# EAGLE design dam1941_extender (EAGLE 9.3.1)
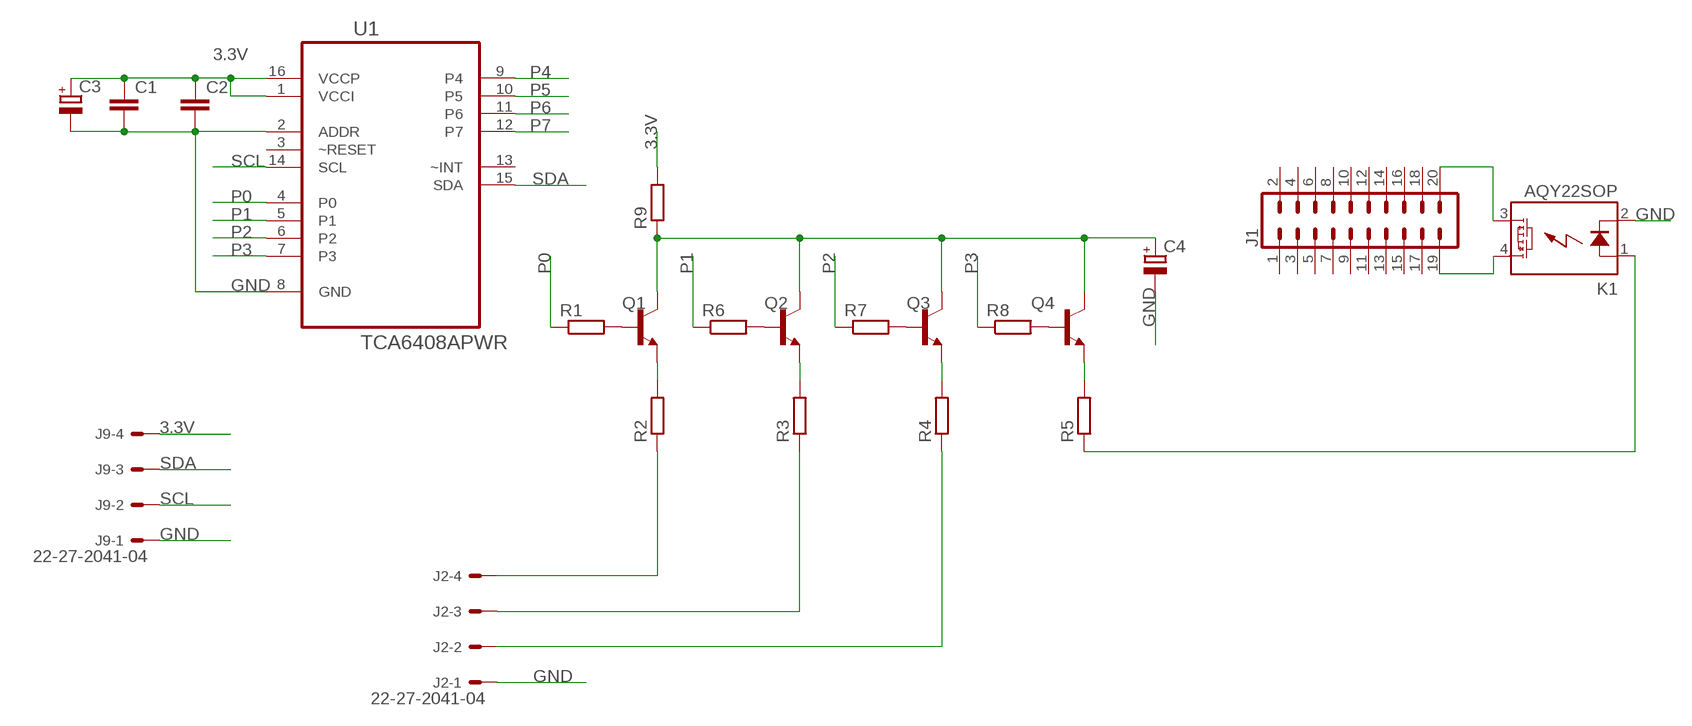
[diagram p0: schematic, sheet 1]

## Parts
C1  C-EUC0805  [C0805]
C2  C-EUC0805  [C0805]
C3  CPOL-EUE2.5-6  [E2,5-6]
C4  CPOL-EUE2.5-6  [E2,5-6]
J1  CONN_10X22X10_LOCK  [2X10_LOCK]
J2  22-27-2041-04  [6410-04]
J9  22-27-2041-04  [6410-04]
K1  AQY22SOP  [SOP04]
Q1  TRANSISTOR_BC850-NPN-SOT23-BEC  [TRANSISTOR_SOT23-BEC]
Q2  TRANSISTOR_BC850-NPN-SOT23-BEC  [TRANSISTOR_SOT23-BEC]
Q3  TRANSISTOR_BC850-NPN-SOT23-BEC  [TRANSISTOR_SOT23-BEC]
Q4  TRANSISTOR_BC850-NPN-SOT23-BEC  [TRANSISTOR_SOT23-BEC]
R1  R-EU_MELF0204W  [MINI_MELF-0204W]
R2  R-EU_MELF0204W  [MINI_MELF-0204W]
R3  R-EU_MELF0204W  [MINI_MELF-0204W]
R4  R-EU_MELF0204W  [MINI_MELF-0204W]
R5  R-EU_MELF0204W  [MINI_MELF-0204W]
R6  R-EU_MELF0204W  [MINI_MELF-0204W]
R7  R-EU_MELF0204W  [MINI_MELF-0204W]
R8  R-EU_MELF0204W  [MINI_MELF-0204W]
R9  R-EU_MELF0204W  [MINI_MELF-0204W]
U1  TCA6408APWR  [SOP65P640X120-16N]

## Nets
3.3V: C1.1 C2.1 C3.+ J9.4 R9.2 U1.1(VCCI) U1.16(VCCP)
GND: C1.2 C2.2 C3.- C4.- J2.1 J9.1 K1.2(K) U1.2(ADDR) U1.8(GND)
N$1: J1.20 K1.3(DS2)
N$2: J1.19 K1.4(DS1)
N$3: C4.+ Q1.C Q2.C Q3.C Q4.C R9.1
N$4: Q1.E R2.2
N$5: Q3.B R7.2
N$6: Q4.B R8.2
N$7: Q2.B R6.2
N$8: Q1.B R1.2
N$9: Q2.E R3.2
N$10: Q3.E R4.2
N$11: Q4.E R5.2
N$12: J2.4 R2.1
N$13: K1.1(A) R5.1
N$14: J2.3 R3.1
N$15: J2.2 R4.1
P0: R1.1 U1.4(P0)
P1: R6.1 U1.5(P1)
P2: R7.1 U1.6(P2)
P3: R8.1 U1.7(P3)
P4: U1.9(P4)
P5: U1.10(P5)
P6: U1.11(P6)
P7: U1.12(P7)
SCL: J9.2 U1.14(SCL)
SDA: J9.3 U1.15(SDA)
Unconnected: J1.1 J1.2 J1.3 J1.4 J1.5 J1.6 J1.7 J1.8 J1.9 J1.10 J1.11 J1.12 J1.13 J1.14 J1.15 J1.16 J1.17 J1.18 U1.3(~RESET) U1.13(~INT)

## Library data of the parts
C1 C2 = Vwvwbg:C-EU: CAPACITOR, European symbol
C3 C4 = Vwvwbg:CPOL-EU: POLARIZED CAPACITOR, European symbol
J1 = SparkFun-Connectors:CONN_10X2: Multi connection point. Often used as Generic Header-pin footprint for 0.1 inch spaced/style header connections On any of the 0.1 inch spaced packages, you can populate with these: Break Away Headers - Straight <https://www.sparkfun.com/products/116> (PRT-00116) Break Away Male Headers - Right Angle <https://www.sparkfun.com/products/553> (PRT-00553) Female Headers <https://www.sparkfun.com/products/115> (PRT-00115) Break Away Headers - Machine Pin <https://www.sparkfun.com/products/117> (PRT-00117) Break Away Female Headers - Swiss Machine Pin <https://www.sparkfun.com/products/743> (PRT-00743) Special note about the "SPECIAL" package: This was SPECIALLY designed to be used with our Graphic LCD Backpack. Be sure you want to use this! It is not only staggered on each line of header holes, but IT IS ALSO offset of the center point of the top and bottom lines by 5 mil. This causes the headers to lock into place on the "standard" footprint on the LCD screen. The extra squares on the tdocu layer are there simply to reference other pins (if you were to actually populate a longer header than ten long - this is what we do with the backpacks).
J2 J9 = con-molex:22-?-04: CONNECTOR wire to board 2.54 mm (.1 inch) pitch header; MF: MOLEX; OC_FARNELL: unknown; OC_NEWARK: unknown
K1 = relay:AQY*: PhotoMOS Relay NAiS Source: http://www.panasonic-electric-works.com/catalogues/downloads/photomos/ds_x615_en_aqz10_20.pdf; OC_FARNELL: unknown; OC_NEWARK: unknown
Q1-Q4 = Vwvwbg:TRANSISTOR_*-NPN-: NPN Transistror BF959 corrected 2008.03.06
R1-R9 = Vwvwbg:R-EU_: RESISTOR, European symbol
U1 = Texas Instruments_By_element14_Batch_1:TCA6408APWR: I/O EXPANDER; MPN: TCA6408APWR; OC_FARNELL: 1903303; OC_NEWARK: 24R9973; PACKAGE: TSSOP-16; SUPPLIER: Texas Instruments

## Board
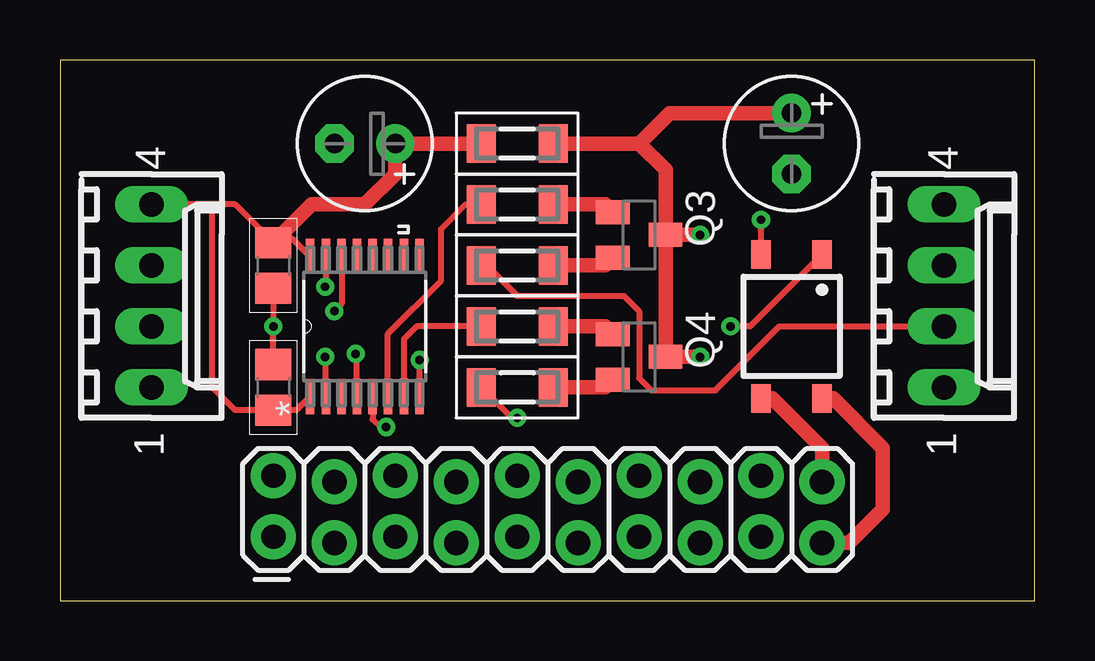
[diagram p1: board, top side]
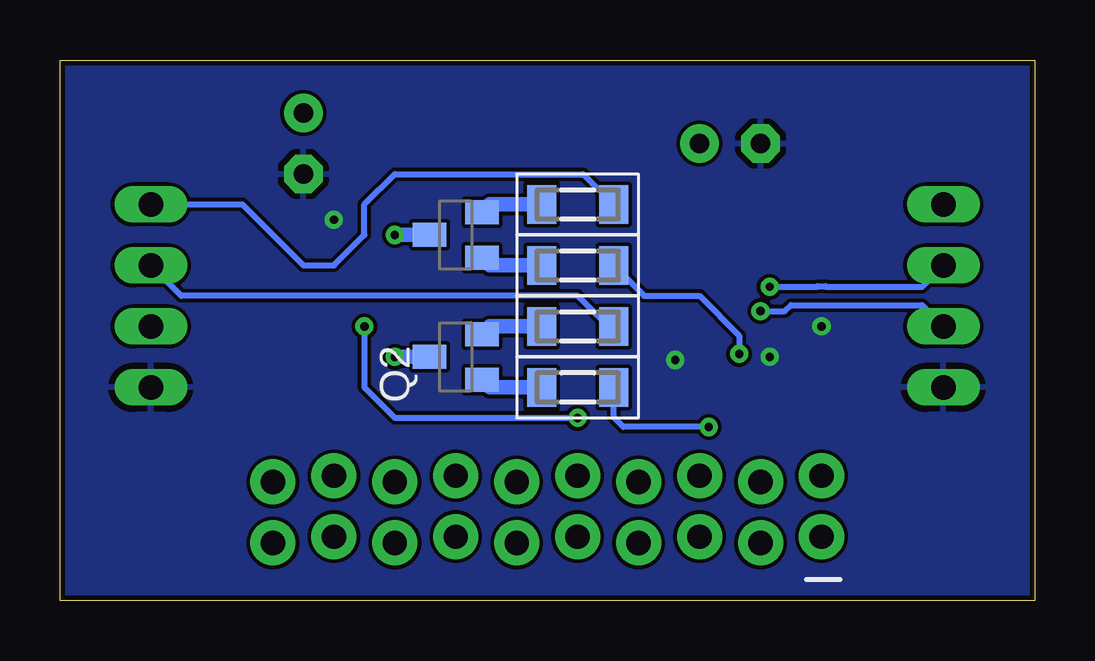
[diagram p2: board, bottom side, seen from below]

Size 40.62 x 22.53 mm. Coordinates in mm from the lower left corner, seen from the top.
Outline: 0,0 40.62,0 40.62,22.53 0,22.53 0,0
Copper layers (1*16): Top 0.035mm / dielectric 1.5mm / Bottom 0.035mm
Design rules "default *": minimum track width 6mil, minimum drill 0.35mm, track to track 6mil, track to pad 6mil, pad to pad 6mil, via to via 6mil, smd to smd 6mil, copper to edge 8mil, drill to drill 6mil, minimum pad ring 10mil, minimum via ring 8mil, stop-mask expansion 4mil, vias tented up to drill 0.36mm, thermal gap 10mil

### Footprints (pad centres in the part's own frame; a part is rotated, then mirrored left to right if it is on the bottom)
C0805 = smd 1.3 x 1.5: 1 -0.95,0; 2 0.95,0
E2,5-6 = drill 0.813 pad 1.6: + -1.27,0 | drill 0.813 pad 1.6 octagon: - 1.27,0
2X10_LOCK = drill 1.016 pad 1.88: 1 0,0.127; 2 0,2.667; 3 2.54,-0.127; 4 2.54,2.413; 5 5.08,0.127; 6 5.08,2.667; 7 7.62,-0.127; 8 7.62,2.413; 9 10.16,0.127; 10 10.16,2.667; 11 12.7,-0.127; 12 12.7,2.413; 13 15.24,0.127; 14 15.24,2.667; 15 17.78,-0.127; 16 17.78,2.413; 17 20.32,0.127; 18 20.32,2.667; 19 22.86,-0.127; 20 22.86,2.413
6410-04 = drill 1.016 long: 1 3.81,0; 2 1.27,0; 3 -1.27,0; 4 -3.81,0
SOP04 = smd 0.8 x 1.2: 1 -1.27,-3; 2 1.27,-3; 3 1.27,3; 4 -1.27,3
TRANSISTOR_SOT23-BEC = smd 1 x 1.4: B -0.95,-1.1; C 0,1.1; E 0.95,-1.1
MINI_MELF-0204W = smd 1.2 x 1.6: 1 -1.5,0; 2 1.5,0
SOP65P640X120-16N = smd 1.473 x 0.356: 1 -2.921,2.286; 2 -2.921,1.626; 3 -2.921,0.965; 4 -2.921,0.33; 5 -2.921,-0.33; 6 -2.921,-0.965; 7 -2.921,-1.626; 8 -2.921,-2.286; 9 2.921,-2.286; 10 2.921,-1.626; 11 2.921,-0.965; 12 2.921,-0.33; 13 2.921,0.33; 14 2.921,0.965; 15 2.921,1.626; 16 2.921,2.286

### Placement (x,y rotation side)
C1  8.89,13.97 270 top
C2  8.89,8.89 90 top
C3  12.7,19.05 180 top
C4  30.48,19.05 270 top
J1  8.89,2.54 0 top
J2  36.83,12.7 270 top
J9  3.81,12.7 270 top
K1  30.48,11.43 180 top
Q1  24.13,15.24 90 bottom
Q2  24.13,10.16 90 bottom
Q3  24.13,15.24 270 top
Q4  24.13,10.16 270 top
R1  19.05,13.97 180 bottom
R2  19.05,16.51 180 bottom
R3  19.05,11.43 180 bottom
R4  19.05,13.97 0 top
R5  19.05,8.89 0 top
R6  19.05,8.89 180 bottom
R7  19.05,16.51 0 top
R8  19.05,11.43 0 top
R9  19.05,19.05 180 top
U1  12.7,11.43 90 top

### Tracks (layer width: path | path; a pad name or v marks a point on that pad's centre or on a via)
3.3V
  Top 0.254: C1.1 8.73,15.08 | 8.73,15.08 7.3,16.51 6.35,16.51 | 6.35,16.51 J9.4 | U1.16 9.69,15.08 8.73,15.08 | U1.1 9.85,7.94 C2.1 7.3,7.94 6.35,8.89 6.35,16.51
  Top 0.61: C1.1 10.48,16.51 12.7,16.51 13.97,17.78 C3.+ R9.2
GND  (via drill 0.35)
  Top 0.254: C2.2 v8.89,11.43 C1.2 | U1.8 v14.99,10.03 | U1.2 11.07,10.13 v11.05,10.16 | K1.2 v29.21,15.88
  pour Bottom: 0,24.13 40.64,24.13 40.64,0 0,0
N$1
  Top 0.61: J1.20 31.75,6.35 29.67,8.43 K1.3
N$2
  Top 0.61: J1.19 32.89,2.41 34.29,3.81 34.29,6.35 32.21,8.43 K1.4
N$3  (via drill 0.35)
  Top 0.61: Q3.C 25.23,17.95 24.13,19.05 | 24.13,19.05 R9.1 | Q3.C Q2.C v26.67,10.16 | 24.13,19.05 25.4,20.32 C4.+ | v26.67,15.24 Q3.C
  Bottom 0.61: Q3.C v26.67,15.24 | v26.67,10.16 Q2.C
N$4
  Bottom 0.61: Q1.E 22.71,16.51 R2.2
N$5
  Top 0.61: Q3.B 22.71,16.51 R7.2
N$6
  Top 0.61: Q4.B 22.71,11.43 R8.2
N$7
  Bottom 0.61: Q2.B 22.71,8.89 R6.2
N$8
  Bottom 0.61: Q1.B 22.71,13.97 R1.2
N$9
  Bottom 0.61: Q2.E 22.71,11.43 R3.2
N$10
  Top 0.61: Q3.E 22.71,13.97 R4.2
N$11
  Top 0.61: Q4.E 22.71,8.89 R5.2
N$12
  Bottom 0.254: J2.4 33.02,16.51 30.48,13.97 29.21,13.97 27.94,15.24 27.94,16.51 26.67,17.78 18.82,17.78 R2.1
N$13  (via drill 0.35)
  Top 0.254: K1.1 28.75,11.43 v27.94,11.43 | v19.05,7.62 18.82,7.62 R5.1
  Bottom 0.254: v27.94,11.43 27.94,8.89 26.67,7.62 v19.05,7.62
N$14
  Bottom 0.254: R3.1 17.78,11.43 19.05,12.7 35.56,12.7 J2.3
N$15
  Top 0.254: R4.1 17.78,13.97 19.05,12.7 23.5,12.7 24.13,12.06 24.13,9.27 24.64,8.76 27.3,8.76 29.97,11.43 J2.2
P0  (via drill 0.35)
  Top 0.254: U1.4 12.37,10.24 v12.32,10.29
  Bottom 0.254: R1.1 16.28,12.7 13.97,12.7 12.32,11.05 v12.32,10.29
P1  (via drill 0.35)
  Top 0.254: U1.5 13.03,7.54 13.34,7.24 v13.59,7.24
  Bottom 0.254: v13.59,7.24 17.14,7.24 17.55,7.64 R6.1
P2
  Top 0.254: U1.6 13.66,11.12 15.88,13.34 15.88,15.49 16.89,16.51 R7.1
P3
  Top 0.254: R8.1 14.86,11.43 14.33,10.9 U1.7
SCL  (via drill 0.35)
  Top 0.254: U1.14 11.73,12.37 v11.43,12.06
  Bottom 0.254: v11.43,12.06 10.41,12.06 10.16,12.32 4.7,12.32 J9.2
SDA  (via drill 0.35)
  Top 0.254: U1.15 11.07,13.11 v11.05,13.08
  Bottom 0.254: J9.3 4.7,13.08 8.7,13.08 8.72,13.11 9.06,13.11 9.08,13.08 v11.05,13.08